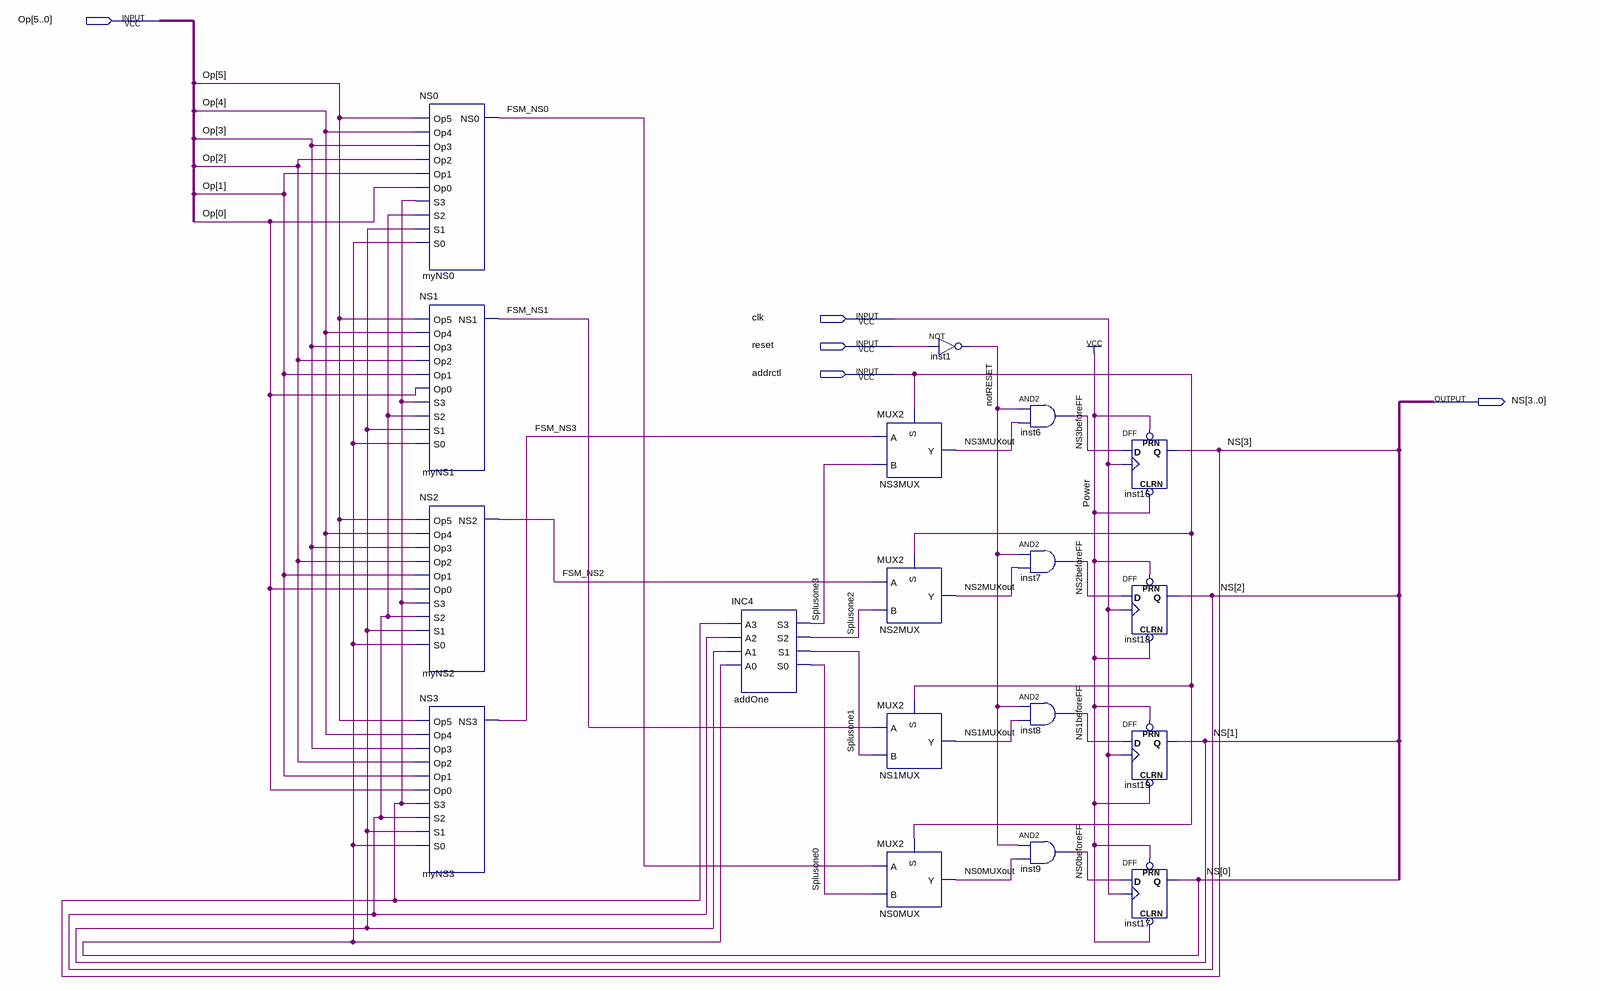
[diagram p0: schematic sheet]
// Quartus schematic FSM.bdf as structural Verilog: 18 symbols, 5 pins
module FSM (
  input  [5:0] Op,
  input  clk,
  input  reset,
  input  addrctl,
  output [3:0] NS
);

  wire FSM_NS0, FSM_NS1, FSM_NS2, FSM_NS3, notRESET, NS0beforeFF, NS0MUXout, NS1beforeFF, NS1MUXout,
       NS2beforeFF, NS2MUXout, NS3beforeFF, NS3MUXout, Splusone0, Splusone1, Splusone2, Splusone3;

  NS0 myNS0 (
    .Op5(Op[5]), .Op4(Op[4]), .Op3(Op[3]), .Op2(Op[2]), .Op1(Op[1]), .Op0(Op[0]), .S3(NS[3]), .S2(NS[2]),
    .S1(NS[1]), .S0(NS[0]), .NS0(FSM_NS0));
  NS1 myNS1 (
    .Op5(Op[5]), .Op4(Op[4]), .Op3(Op[3]), .Op2(Op[2]), .Op1(Op[1]), .Op0(Op[0]), .S3(NS[3]), .S2(NS[2]),
    .S1(NS[1]), .S0(NS[0]), .NS1(FSM_NS1));
  NS2 myNS2 (
    .Op5(Op[5]), .Op4(Op[4]), .Op3(Op[3]), .Op2(Op[2]), .Op1(Op[1]), .Op0(Op[0]), .S3(NS[3]), .S2(NS[2]),
    .S1(NS[1]), .S0(NS[0]), .NS2(FSM_NS2));
  NS3 myNS3 (
    .Op5(Op[5]), .Op4(Op[4]), .Op3(Op[3]), .Op2(Op[2]), .Op1(Op[1]), .Op0(Op[0]), .S3(NS[3]), .S2(NS[2]),
    .S1(NS[1]), .S0(NS[0]), .NS3(FSM_NS3));
  INC4 addOne (
    .A3(NS[3]), .A2(NS[2]), .A1(NS[1]), .A0(NS[0]), .S3(Splusone3), .S2(Splusone2), .S1(Splusone1),
    .S0(Splusone0));
  MUX2 NS3MUX (.S(addrctl), .A(FSM_NS3), .B(Splusone3), .Y(NS3MUXout));
  MUX2 NS2MUX (.S(addrctl), .A(FSM_NS2), .B(Splusone2), .Y(NS2MUXout));
  MUX2 NS1MUX (.S(addrctl), .A(FSM_NS1), .B(Splusone1), .Y(NS1MUXout));
  MUX2 NS0MUX (.S(addrctl), .A(FSM_NS0), .B(Splusone0), .Y(NS0MUXout));
  not inst1 (notRESET, reset);
  and inst6 (NS3beforeFF, notRESET, NS3MUXout);
  and inst7 (NS2beforeFF, notRESET, NS2MUXout);
  and inst8 (NS1beforeFF, notRESET, NS1MUXout);
  and inst9 (NS0beforeFF, notRESET, NS0MUXout);
  DFF inst16 (.CLRN(1'b1), .CLK(clk), .D(NS3beforeFF), .PRN(1'b1), .Q(NS[3]));
  DFF inst18 (.CLRN(1'b1), .CLK(clk), .D(NS2beforeFF), .PRN(1'b1), .Q(NS[2]));
  DFF inst19 (.CLRN(1'b1), .CLK(clk), .D(NS1beforeFF), .PRN(1'b1), .Q(NS[1]));
  DFF inst17 (.CLRN(1'b1), .CLK(clk), .D(NS0beforeFF), .PRN(1'b1), .Q(NS[0]));
endmodule
